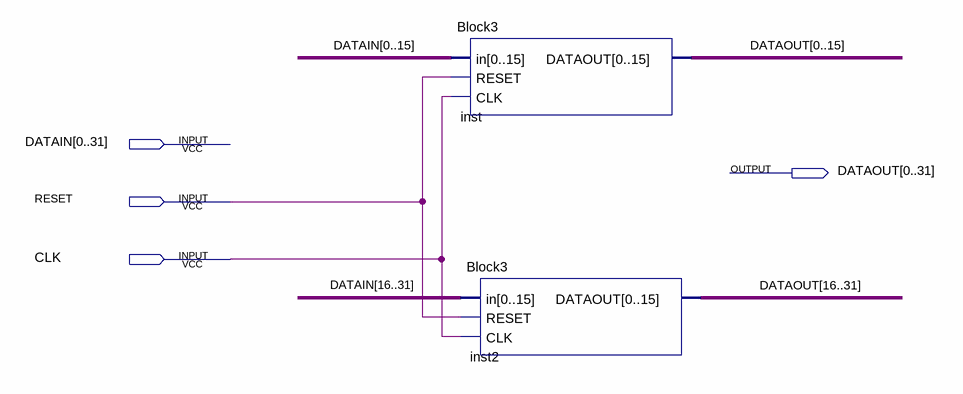
[diagram p0: schematic sheet]
// Quartus schematic Block4.bdf as structural Verilog: 2 symbols, 4 pins
module Block4 (
  input  [0:31] DATAIN,
  input  RESET,
  input  CLK,
  output [0:31] DATAOUT
);

  Block3 inst (.in(DATAIN[0:15]), .RESET(RESET), .CLK(CLK), .DATAOUT(DATAOUT[0:15]));
  Block3 inst2 (.in(DATAIN[16:31]), .RESET(RESET), .CLK(CLK), .DATAOUT(DATAOUT[16:31]));
endmodule
